# Altium schematic sheet ModuleNguonCungCap.SchDoc
size A
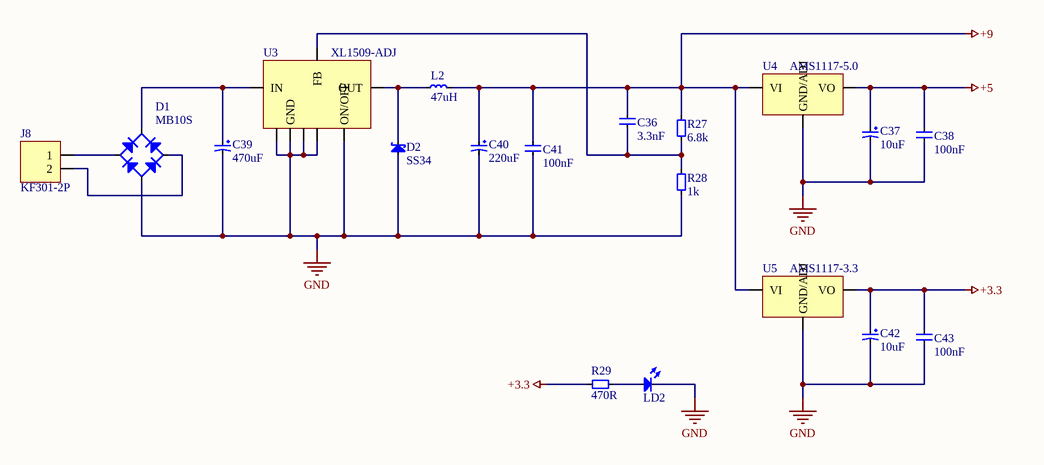
[diagram p0: ModuleNguonCungCap.SchDoc]

## Parts
C36  3.3nF  [C-0805]
C37  10uF  [C-ELE-1.5-4X7MM]
C38  100nF  [C-0805]
C39  470uF  [C-ELE-2.5-6.3X11MM]
C40  220uF  [C-ELE-2.5-6.3X11MM]
C41  100nF  [C-0805]
C42  10uF  [C-ELE-1.5-4X7MM]
C43  100nF  [C-0805]
D1  MB10S  [BRIDGE-MBS]
D2  SS34  [DO-214AC-SMA]
J8  KF301-2P  [KF301-2P-5.0]
L2  47uH  [L-PK0608-2.5-7X10MM]
LD2  PWR  [LED-0805-RED]  (value not drawn)
R27  6.8k  [R-0805]
R28  1k  [R-0805]
R29  470R  [R-0805]
U3  XL1509-ADJ  [SO8-1.27-150MIL]
U4  AMS1117-5.0  [SOT223]
U5  AMS1117-3.3  [SOT223]

## Nets
+3.3: C42.1 C43.2 R29.1 U5.2(VO)
+5: C37.1 C38.2 U4.2(VO)
+9: C36.2 C40.1 C41.2 L2.2 R27.2 U4.3(VI) U5.3(VI)
GND: C37.2 C38.1 C39.2 C40.2 C41.1 C42.2 C43.1 D1.DC- D2.1 LD2.2 R28.1 U3.4(ON/OFF) U3.5(GND) U3.6(GND) U3.7(GND) U3.8(GND) U4.1(GND/ADJ) U5.1(GND/ADJ)
NetC36_1: C36.1 R27.1 R28.2 U3.3(FB)
NetC39_1: C39.1 D1.DC+ U3.1(IN)
NetD1_AC1: D1.AC1 J8.1
NetD1_AC2: D1.AC2 J8.2
NetD2_2: D2.2 L2.1 U3.2(OUT)
NetLD2_1: LD2.1 R29.2

## Library data of the parts
C36 C38 C41 C43 = CAP: Cac Loai Tu Khong Phan Cuc
C37 C39 C40 C42 = CAP-ELE: Cac Loai Tu Hoa
D1 = BRIDGE: Cac Loai Diode Cau
D2 = SS34: Diode Schottky 1N5822 3A 40V Dan
J8 = KF301-2P: Dau Ket Noi KF301 2 Chan
L2 = IND: Cac Loai Cuon Cam Don
LD2 = LED: Cac Loai LED Don
R27-R29 = RES: Cac Loai Dien Tro
U3 = XL1509: IC On Ap Chuyen Mach 2A
U4 U5 = AMS1117: IC On Ap Tuyen Tinh AMS1117 1A